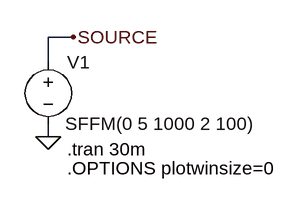
[diagram p0: schematic Fig_2-38_V-source-SFFM.asc]
Fig_2-38_V-source-SFFM.asc, the LTspice schematic file:
Version 4
SHEET 1 880 680
WIRE 144 80 112 80
WIRE 112 112 112 80
WIRE 112 208 112 192
FLAG 112 208 0
FLAG 144 80 SOURCE
SYMBOL voltage 112 96 R0
WINDOW 3 22 95 Left 2
WINDOW 123 0 0 Left 2
WINDOW 39 0 0 Left 2
SYMATTR Value SFFM(0 5 1000 2 100)
SYMATTR InstName V1
TEXT 136 224 Left 2 !.tran 30m
TEXT 136 248 Left 2 !.OPTIONS plotwinsize=0

The netlist it stands for:
* Fig_2-38_V-source-SFFM.asc
V1 SOURCE 0 SFFM(0 5 1000 2 100)
.tran 30m
.OPTIONS plotwinsize=0
.backanno
.end